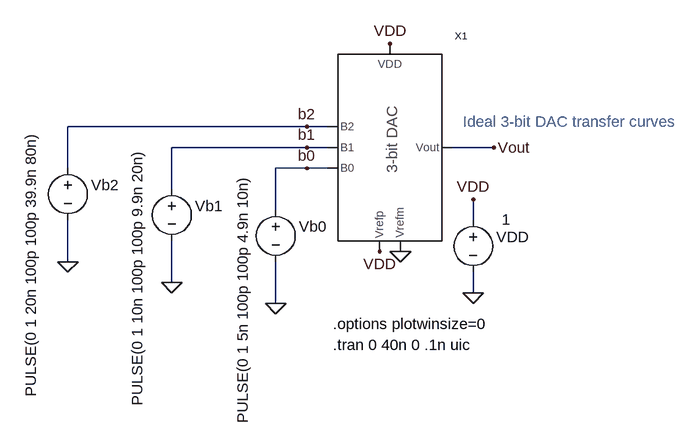
[diagram p0: schematic Fig28_10.asc]
Fig28_10.asc, the LTspice schematic file:
Version 4
SHEET 1 1344 696
WIRE 688 128 320 128
WIRE 720 128 688 128
WIRE 688 160 480 160
WIRE 720 160 688 160
WIRE 976 160 912 160
WIRE 320 192 320 128
WIRE 688 192 640 192
WIRE 720 192 688 192
WIRE 480 224 480 160
WIRE 640 256 640 192
WIRE 944 272 944 240
WIRE 320 336 320 272
WIRE 480 368 480 304
WIRE 944 384 944 352
WIRE 640 400 640 336
FLAG 640 400 0
FLAG 976 160 Vout
FLAG 832 320 0
FLAG 800 320 VDD
FLAG 816 0 VDD
FLAG 480 368 0
FLAG 320 336 0
FLAG 944 384 0
FLAG 944 240 VDD
FLAG 688 192 b0
FLAG 688 160 b1
FLAG 688 128 b2
SYMBOL voltage 640 240 R0
WINDOW 0 36 42 Left 0
WINDOW 3 -51 345 VLeft 0
WINDOW 123 0 0 Left 0
WINDOW 39 0 0 Left 0
SYMATTR InstName Vb0
SYMATTR Value PULSE(0 1 5n 100p 100p 4.9n 10n)
SYMBOL voltage 480 208 R0
WINDOW 0 36 42 Left 0
WINDOW 3 -53 350 VLeft 0
WINDOW 123 0 0 Left 0
WINDOW 39 0 0 Left 0
SYMATTR InstName Vb1
SYMATTR Value PULSE(0 1 10n 100p 100p 9.9n 20n)
SYMBOL voltage 320 176 R0
WINDOW 0 36 42 Left 0
WINDOW 3 -57 368 VLeft 0
WINDOW 123 0 0 Left 0
WINDOW 39 0 0 Left 0
SYMATTR InstName Vb2
SYMATTR Value PULSE(0 1 20n 100p 100p 39.9n 80n)
SYMBOL voltage 944 256 R0
WINDOW 0 36 42 Left 0
WINDOW 3 44 15 Left 0
WINDOW 123 0 0 Left 0
WINDOW 39 0 0 Left 0
SYMATTR InstName VDD
SYMATTR Value 1
SYMBOL Ideal_3_bit_DAC 736 304 R0
SYMATTR InstName X1
TEXT 728 464 Left 0 !.tran 0 40n 0 .1n uic
TEXT 728 432 Left 0 !.options plotwinsize=0
TEXT 928 120 Left 0 ;Ideal 3-bit DAC transfer curves

The netlist it stands for:
* Fig28_10.asc
Vb0 b0 0 PULSE(0 1 5n 100p 100p 4.9n 10n)
Vb1 b1 0 PULSE(0 1 10n 100p 100p 9.9n 20n)
Vb2 b2 0 PULSE(0 1 20n 100p 100p 39.9n 80n)
VDD VDD 0 1
XX1 b2 b1 b0 Vout VDD 0 VDD Ideal_3_bit_DAC  ; pins B2 B1 B0 Vout Vrefp Vrefm VDD
.tran 0 40n 0 .1n uic
.options plotwinsize=0
* Ideal 3-bit DAC transfer curves
.backanno
.end